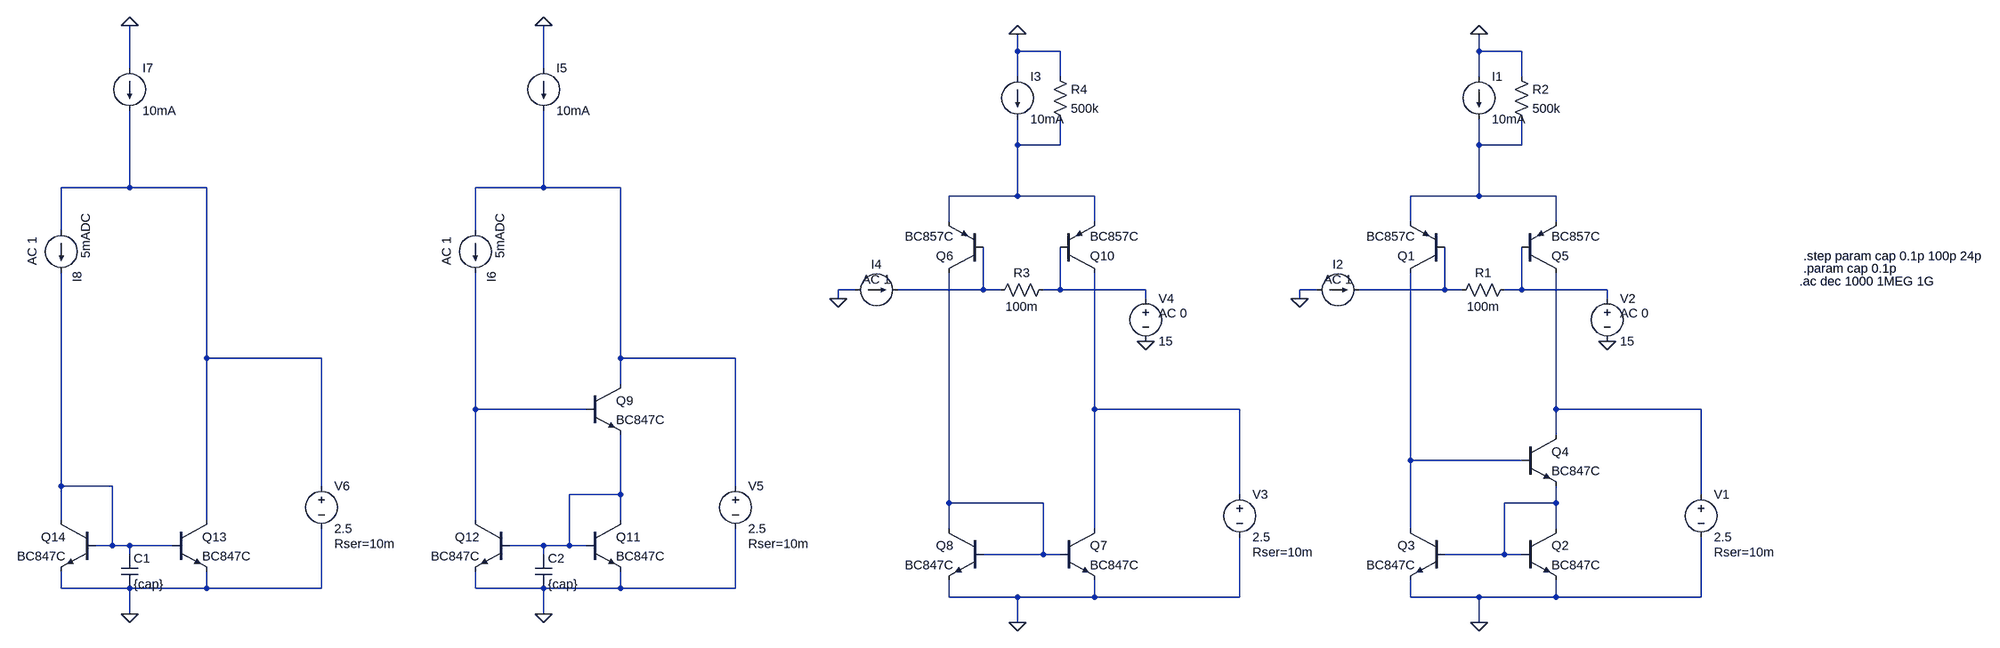
[diagram p0: schematic wilson-test.asc]
wilson-test.asc, the LTspice schematic file:
Version 4
SHEET 1 1000 680
WIRE -832 -672 -832 -704
WIRE -752 -672 -832 -672
WIRE 32 -672 32 -704
WIRE 112 -672 32 -672
WIRE -2608 -640 -2608 -720
WIRE -1776 -640 -1776 -720
WIRE -832 -624 -832 -672
WIRE -752 -624 -752 -672
WIRE 32 -624 32 -672
WIRE 112 -624 112 -672
WIRE -832 -496 -832 -544
WIRE -752 -496 -752 -544
WIRE -752 -496 -832 -496
WIRE 32 -496 32 -544
WIRE 112 -496 112 -544
WIRE 112 -496 32 -496
WIRE -2608 -416 -2608 -560
WIRE -2608 -416 -2736 -416
WIRE -2464 -416 -2608 -416
WIRE -1776 -416 -1776 -560
WIRE -1776 -416 -1904 -416
WIRE -1632 -416 -1776 -416
WIRE -832 -400 -832 -496
WIRE -832 -400 -960 -400
WIRE -688 -400 -832 -400
WIRE 32 -400 32 -496
WIRE 32 -400 -96 -400
WIRE 176 -400 32 -400
WIRE -960 -352 -960 -400
WIRE -688 -352 -688 -400
WIRE -96 -352 -96 -400
WIRE 176 -352 176 -400
WIRE -2736 -336 -2736 -416
WIRE -1904 -336 -1904 -416
WIRE -1136 -224 -1168 -224
WIRE -896 -224 -896 -304
WIRE -896 -224 -1056 -224
WIRE -864 -224 -896 -224
WIRE -752 -224 -752 -304
WIRE -752 -224 -784 -224
WIRE -592 -224 -752 -224
WIRE -272 -224 -304 -224
WIRE -32 -224 -32 -304
WIRE -32 -224 -192 -224
WIRE 0 -224 -32 -224
WIRE 112 -224 112 -304
WIRE 112 -224 80 -224
WIRE 272 -224 112 -224
WIRE -1168 -208 -1168 -224
WIRE -592 -208 -592 -224
WIRE -304 -208 -304 -224
WIRE 272 -208 272 -224
WIRE -2464 -96 -2464 -416
WIRE -2192 -96 -2464 -96
WIRE -1632 -96 -1632 -416
WIRE -1360 -96 -1632 -96
WIRE -1632 -48 -1632 -96
WIRE -1904 0 -1904 -256
WIRE -1696 0 -1904 0
WIRE -688 0 -688 -256
WIRE -416 0 -688 0
WIRE 176 0 176 -256
WIRE 448 0 176 0
WIRE 176 48 176 0
WIRE -96 96 -96 -256
WIRE 112 96 -96 96
WIRE -2736 144 -2736 -256
WIRE -2640 144 -2736 144
WIRE -2192 144 -2192 -96
WIRE -1360 144 -1360 -96
WIRE -1632 160 -1632 48
WIRE -1632 160 -1728 160
WIRE -416 160 -416 0
WIRE 448 160 448 0
WIRE -960 176 -960 -256
WIRE -784 176 -960 176
WIRE 176 176 176 144
WIRE 176 176 80 176
WIRE -2736 208 -2736 144
WIRE -2464 208 -2464 -96
WIRE -1904 208 -1904 0
WIRE -1632 208 -1632 160
WIRE -960 224 -960 176
WIRE -688 224 -688 0
WIRE -96 224 -96 96
WIRE 176 224 176 176
WIRE -2640 256 -2640 144
WIRE -2640 256 -2672 256
WIRE -2608 256 -2640 256
WIRE -2528 256 -2608 256
WIRE -1776 256 -1840 256
WIRE -1728 256 -1728 160
WIRE -1728 256 -1776 256
WIRE -1696 256 -1728 256
WIRE -2608 272 -2608 256
WIRE -1776 272 -1776 256
WIRE -784 272 -784 176
WIRE -784 272 -896 272
WIRE -752 272 -784 272
WIRE 80 272 80 176
WIRE 80 272 -32 272
WIRE 112 272 80 272
WIRE -2736 336 -2736 304
WIRE -2608 336 -2736 336
WIRE -2464 336 -2464 304
WIRE -2464 336 -2608 336
WIRE -2192 336 -2192 224
WIRE -2192 336 -2464 336
WIRE -1904 336 -1904 304
WIRE -1776 336 -1904 336
WIRE -1632 336 -1632 304
WIRE -1632 336 -1776 336
WIRE -1360 336 -1360 224
WIRE -1360 336 -1632 336
WIRE -960 352 -960 320
WIRE -832 352 -960 352
WIRE -688 352 -688 320
WIRE -688 352 -832 352
WIRE -416 352 -416 240
WIRE -416 352 -688 352
WIRE -96 352 -96 320
WIRE 32 352 -96 352
WIRE 176 352 176 320
WIRE 176 352 32 352
WIRE 448 352 448 240
WIRE 448 352 176 352
WIRE -2608 384 -2608 336
WIRE -1776 384 -1776 336
WIRE -832 400 -832 352
WIRE 32 400 32 352
FLAG 32 -704 0
FLAG 32 400 0
FLAG -304 -208 0
FLAG 272 -128 0
FLAG -832 -704 0
FLAG -832 400 0
FLAG -1168 -208 0
FLAG -592 -128 0
FLAG -1776 -720 0
FLAG -1776 384 0
FLAG -2608 -720 0
FLAG -2608 384 0
DATAFLAG -752 -400 ""
DATAFLAG 112 -400 ""
DATAFLAG -960 -32 "Ic(Q6)"
DATAFLAG -688 -32 "Ic(Q10)"
DATAFLAG -96 -48 "Ic(Q1)"
DATAFLAG 176 -48 "Ic(Q5)"
DATAFLAG -1904 -48 "I(I6)"
DATAFLAG -1632 96 "Ic(Q11)"
DATAFLAG -1488 -96 "I(V5)"
DATAFLAG -2736 -48 "I(I8)"
DATAFLAG -2464 96 "Ic(Q13)"
DATAFLAG -2320 -96 "I(V5)"
SYMBOL pnp -32 -256 R180
SYMATTR InstName Q1
SYMATTR Value BC857C
SYMBOL npn 112 224 R0
SYMATTR InstName Q2
SYMATTR Value BC847C
SYMBOL npn -32 224 M0
SYMATTR InstName Q3
SYMATTR Value BC847C
SYMBOL npn 112 48 R0
SYMATTR InstName Q4
SYMATTR Value BC847C
SYMBOL pnp 112 -256 M180
SYMATTR InstName Q5
SYMATTR Value BC857C
SYMBOL res 96 -240 R90
WINDOW 0 0 56 VBottom 2
WINDOW 3 32 56 VTop 2
SYMATTR InstName R1
SYMATTR Value 100m
SYMBOL current 32 -624 R0
WINDOW 123 0 0 Left 0
WINDOW 39 0 0 Left 0
SYMATTR InstName I1
SYMATTR Value 10mA
SYMBOL res 96 -640 R0
SYMATTR InstName R2
SYMATTR Value 500k
SYMBOL voltage 448 144 R0
WINDOW 123 0 0 Left 0
WINDOW 39 24 124 Left 2
SYMATTR InstName V1
SYMATTR Value 2.5
SYMATTR SpiceLine Rser=10m
SYMBOL current -272 -224 R270
WINDOW 0 32 40 VTop 2
WINDOW 3 -32 40 VBottom 2
WINDOW 123 4 40 VTop 2
WINDOW 39 0 0 Left 0
SYMATTR InstName I2
SYMATTR Value ""
SYMATTR Value2 AC 1
SYMBOL voltage 272 -224 R0
WINDOW 123 24 44 Left 2
WINDOW 39 0 0 Left 0
SYMATTR InstName V2
SYMATTR Value 15
SYMATTR Value2 AC 0
SYMBOL pnp -896 -256 R180
SYMATTR InstName Q6
SYMATTR Value BC857C
SYMBOL npn -752 224 R0
SYMATTR InstName Q7
SYMATTR Value BC847C
SYMBOL npn -896 224 M0
SYMATTR InstName Q8
SYMATTR Value BC847C
SYMBOL pnp -752 -256 M180
SYMATTR InstName Q10
SYMATTR Value BC857C
SYMBOL res -768 -240 R90
WINDOW 0 0 56 VBottom 2
WINDOW 3 32 56 VTop 2
SYMATTR InstName R3
SYMATTR Value 100m
SYMBOL current -832 -624 R0
WINDOW 123 0 0 Left 0
WINDOW 39 0 0 Left 0
SYMATTR InstName I3
SYMATTR Value 10mA
SYMBOL res -768 -640 R0
SYMATTR InstName R4
SYMATTR Value 500k
SYMBOL voltage -416 144 R0
WINDOW 123 0 0 Left 0
WINDOW 39 24 124 Left 2
SYMATTR InstName V3
SYMATTR Value 2.5
SYMATTR SpiceLine Rser=10m
SYMBOL current -1136 -224 R270
WINDOW 0 32 40 VTop 2
WINDOW 3 -32 40 VBottom 2
WINDOW 123 4 40 VTop 2
WINDOW 39 0 0 Left 0
SYMATTR InstName I4
SYMATTR Value ""
SYMATTR Value2 AC 1
SYMBOL voltage -592 -224 R0
WINDOW 123 24 44 Left 2
WINDOW 39 0 0 Left 0
SYMATTR InstName V4
SYMATTR Value 15
SYMATTR Value2 AC 0
SYMBOL npn -1696 208 R0
SYMATTR InstName Q11
SYMATTR Value BC847C
SYMBOL npn -1840 208 M0
SYMATTR InstName Q12
SYMATTR Value BC847C
SYMBOL current -1776 -640 R0
WINDOW 123 0 0 Left 0
WINDOW 39 0 0 Left 0
SYMATTR InstName I5
SYMATTR Value 10mA
SYMBOL voltage -1360 128 R0
WINDOW 123 0 0 Left 0
WINDOW 39 24 124 Left 2
SYMATTR InstName V5
SYMATTR Value 2.5
SYMATTR SpiceLine Rser=10m
SYMBOL current -1904 -336 R0
WINDOW 0 15 88 VTop 2
WINDOW 3 31 11 VTop 2
WINDOW 123 -69 40 VTop 2
WINDOW 39 0 0 Left 0
SYMATTR InstName I6
SYMATTR Value 5mADC
SYMATTR Value2 AC 1
SYMBOL npn -1696 -48 R0
SYMATTR InstName Q9
SYMATTR Value BC847C
SYMBOL npn -2528 208 R0
SYMATTR InstName Q13
SYMATTR Value BC847C
SYMBOL npn -2672 208 M0
SYMATTR InstName Q14
SYMATTR Value BC847C
SYMBOL current -2608 -640 R0
WINDOW 123 0 0 Left 0
WINDOW 39 0 0 Left 0
SYMATTR InstName I7
SYMATTR Value 10mA
SYMBOL voltage -2192 128 R0
WINDOW 123 0 0 Left 0
WINDOW 39 24 124 Left 2
SYMATTR InstName V6
SYMATTR Value 2.5
SYMATTR SpiceLine Rser=10m
SYMBOL current -2736 -336 R0
WINDOW 0 15 88 VTop 2
WINDOW 3 31 11 VTop 2
WINDOW 123 -69 40 VTop 2
WINDOW 39 0 0 Left 0
SYMATTR InstName I8
SYMATTR Value 5mADC
SYMATTR Value2 AC 1
SYMBOL cap -2624 272 R0
SYMATTR InstName C1
SYMATTR Value {cap}
SYMBOL cap -1792 272 R0
SYMATTR InstName C2
SYMATTR Value {cap}
TEXT 632 -240 Left 2 !.ac dec 1000 1MEG 1G
TEXT 640 -264 Left 2 !.param cap 0.1p
TEXT 640 -288 Left 2 !.step param cap 0.1p 100p 24p

The netlist it stands for:
* wilson-test.asc
Q1 N012 N007 N002 0 BC857C
Q2 N016 N016 0 0 BC847C
Q3 N012 N016 0 0 BC847C
Q4 N011 N012 N016 0 BC847C
Q5 N011 N008 N002 0 BC857C
R1 N008 N007 100m
I1 0 N002 10mA
R2 0 N002 500k
V1 N011 0 2.5 Rser=10m
I2 0 N007 AC 1
V2 N008 0 15 AC 0
Q6 N015 N005 N001 0 BC857C
Q7 N010 N015 0 0 BC847C
Q8 N015 N015 0 0 BC847C
Q10 N010 N006 N001 0 BC857C
R3 N006 N005 100m
I3 0 N001 10mA
R4 0 N001 500k
V3 N010 0 2.5 Rser=10m
I4 0 N005 AC 1
V4 N006 0 15 AC 0
Q11 N014 N014 0 0 BC847C
Q12 N009 N014 0 0 BC847C
I5 0 N004 10mA
V5 N004 0 2.5 Rser=10m
I6 N004 N009 5mADC AC 1
Q9 N004 N009 N014 0 BC847C
Q13 N003 N013 0 0 BC847C
Q14 N013 N013 0 0 BC847C
I7 0 N003 10mA
V6 N003 0 2.5 Rser=10m
I8 N003 N013 5mADC AC 1
C1 N013 0 {cap}
C2 N014 0 {cap}
.model NPN NPN
.model PNP PNP
.lib standard.bjt
.ac dec 1000 1MEG 1G
.param cap 0.1p
.step param cap 0.1p 100p 24p
.backanno
.end